# EAGLE design TinyTOG (EAGLE 4.16)
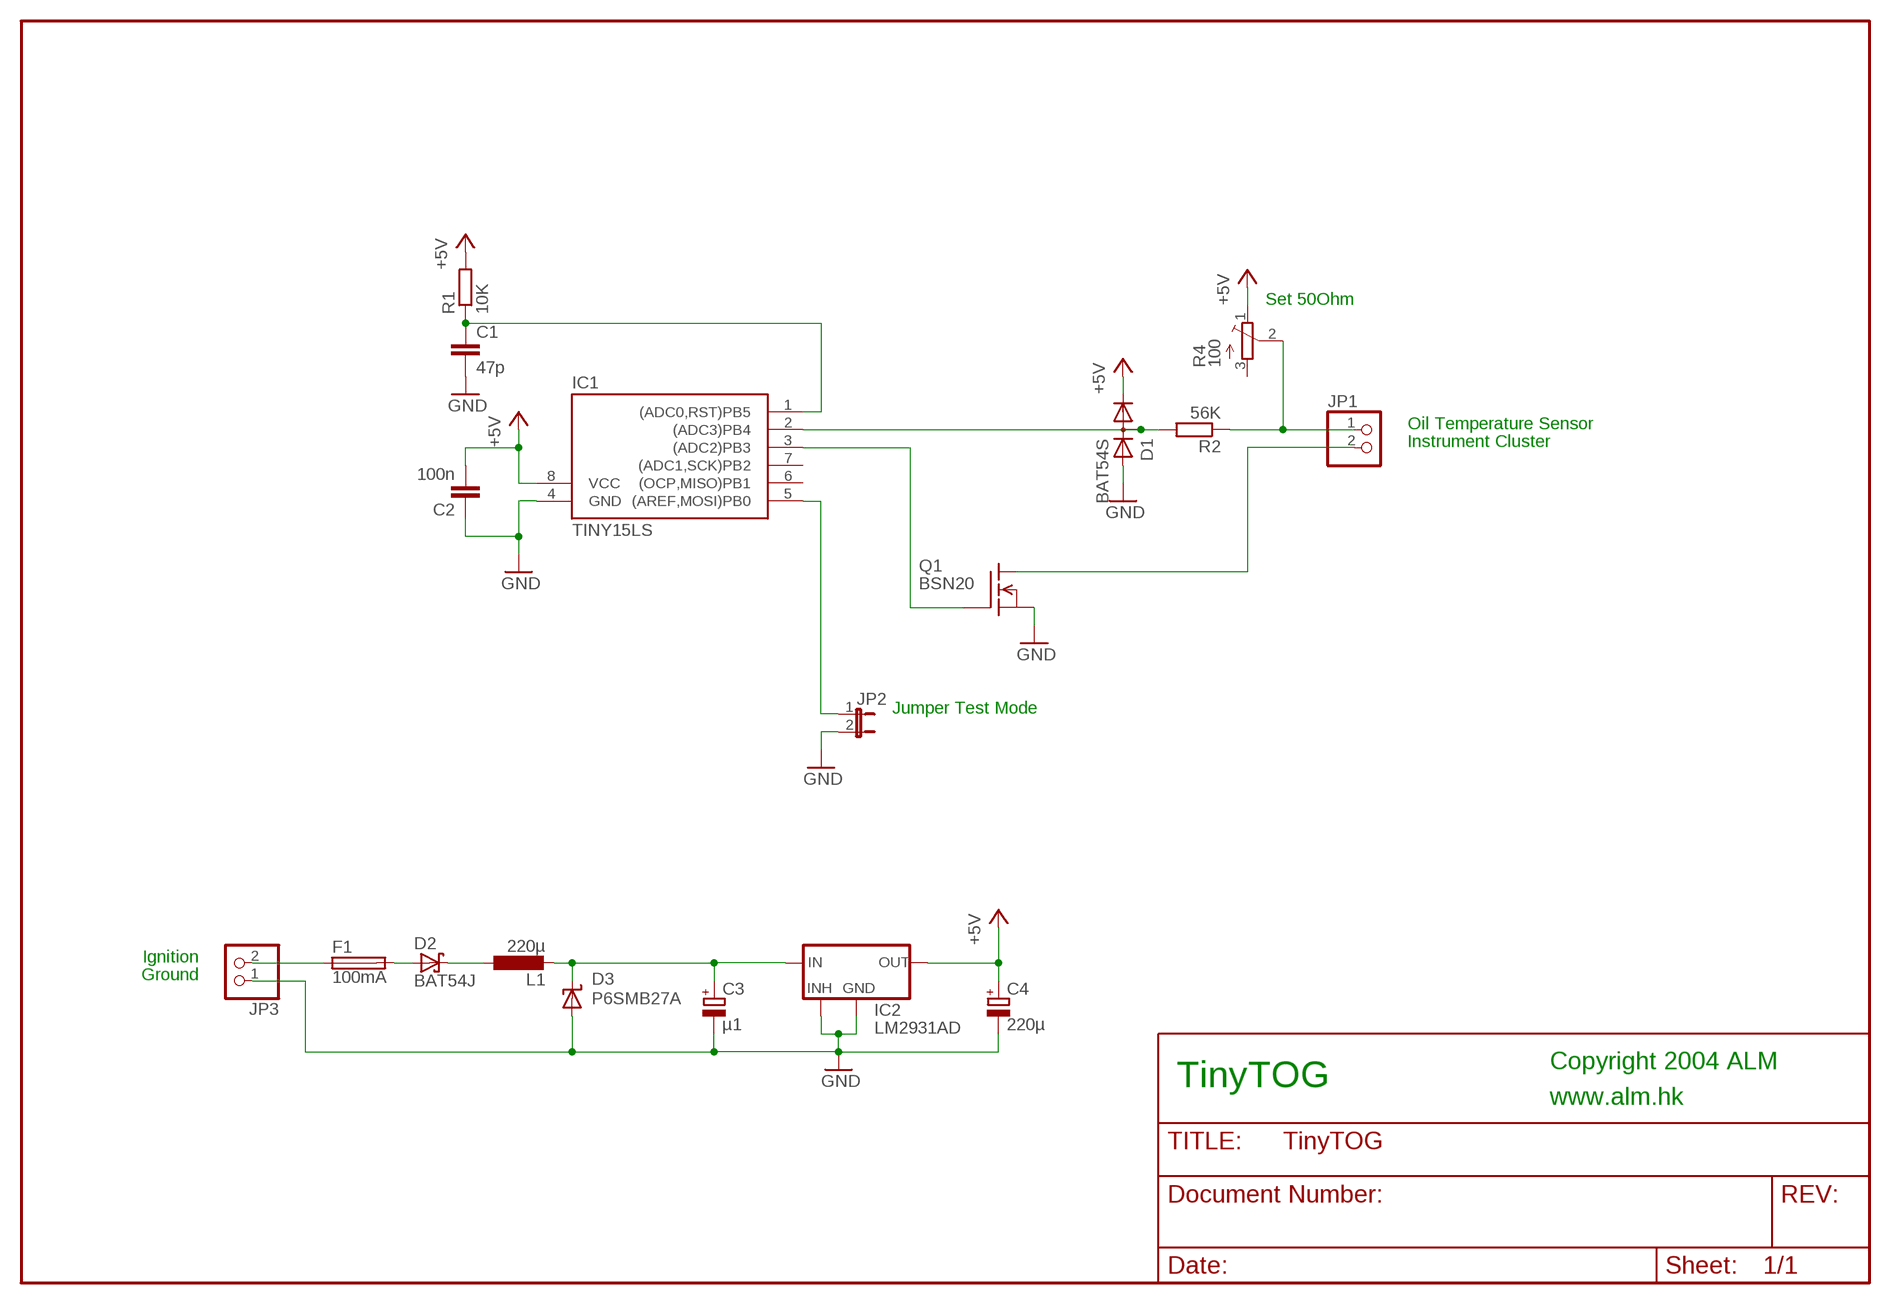
[diagram p0: schematic, sheet 1]

## Parts
C1  47p  C-EUC0805K  [C0805K]
C2  100n  C-EUC0805K  [C0805K]
C3  µ1  CPOL-EUSMCB  [SMC_B]
C4  220µ  CPOL-EUSMCC  [SMC_C]
D1  BAT54S  [SOT23]
D2  BAT54J  [SOD323]
D3  P6SMB27A  SUPPRESSOR-SMBJ  [SMBJ]
F1  100mA  MF-NSMF  [R1206W]
IC1  TINY15LS  [SOIC8]
IC2  LM2931AD  [SO08]
JP1  PINHD-1X2  [1X02]
JP2  JP1E  [JP1]
JP3  PINHD-1X2  [1X02]
L1  220µ  L-EU0207/7  [0207/7]
Q1  BSN20  [SOT23]
R1  10K  R-EU_R1206W  [R1206W]
R2  56K  R-EU_R1206W  [R1206W]
R4  100  TRIM_EU-B64WX  [B64WX]

## Nets
+5V: C2.2 C4.+ D1.2(C) IC1.8(VCC) IC2.1(OUT) R1.2 R4.1(E)
GND: C1.2 C2.1 C3.- C4.- D1.1(A) D3.A IC1.4(GND) IC2.2(GND) IC2.5(INH) JP2.2 JP3.1 Q1.2(S)
N$1: IC1.3((ADC2)PB3) Q1.1(G)
N$2: IC1.5((AREF,MOSI)PB0) JP2.1
N$3: C1.1 IC1.1((ADC0,RST)PB5) R1.1
N$4: JP1.1 R2.1 R4.2(S)
N$5: JP1.2 Q1.3(D)
N$6: D1.3(AC) IC1.2((ADC3)PB4) R2.2
N$7: C3.+ D3.C IC2.8(IN) L1.2
N$8: F1.1 JP3.2
N$9: D2.A F1.2
N$10: D2.K(C) L1.1
Unconnected: IC1.6((OCP,MISO)PB1) IC1.7((ADC1,SCK)PB2) R4.3(A)

## Notes on the sheet
- Set 50Ohm
- Oil Temperature Sensor
- Instrument Cluster
- Jumper Test Mode
- Ignition
- Ground
- Copyright 2004 ALM
- TinyTOG
- www.alm.hk

## Power pins joined to a net without a drawn wire
GND: IC2.3(GND) IC2.6(GND) IC2.7(GND)

## Library data of the parts
C1 C2 = rcl:C-EU: CAPACITOR, European symbol
C3 C4 = rcl:CPOL-EU: POLARIZED CAPACITOR, European symbol
D1 = diode:BAT54S
D2 = diode:BAT54J
D3 = diode:SUPPRESSOR-: Suppressor diode
F1 = eigene:MF-NSMF
IC1 = avr:TINY15L: MICROCONTROLLER 2.7 V 1 Kbytes FLASH 64 bytes EEPROM 4-channel 10 bit ADC
IC2 = eigene:LM2931AD
JP1 JP3 = pinhead:PINHD-1X2: PIN HEADER
JP2 = jumper:JP1E: JUMPER
L1 = rcl:L-EU: INDUCTOR, European symbol
Q1 = eigene:BSN20
R1 R2 = rcl:R-EU_: RESISTOR, European symbol
R4 = pot:TRIM_EU-: POTENTIOMETER

## Net classes
0 default: width 0.254 mm, clearance 0.6 mm

## Board
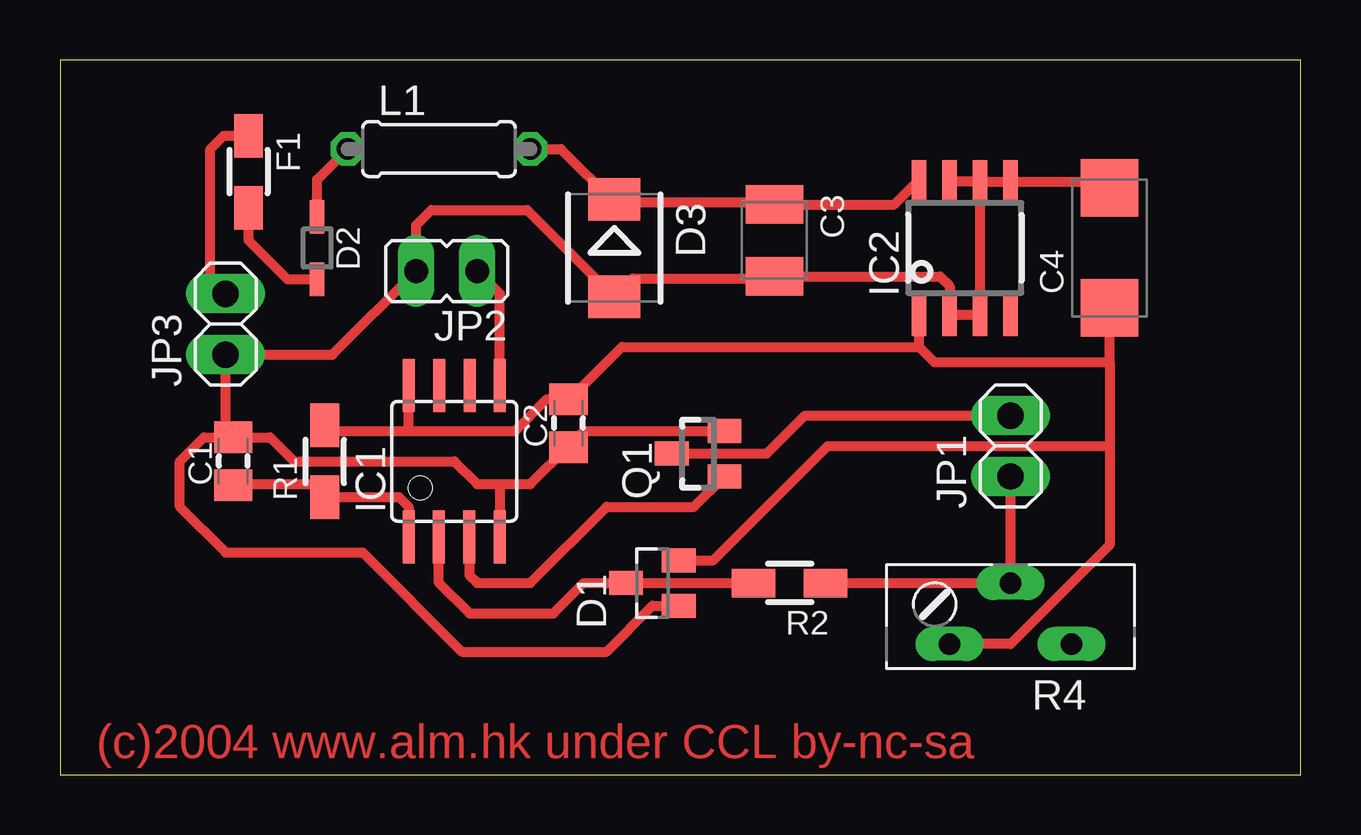
[diagram p1: board, top side]

Size 51.7 x 29.81 mm. Coordinates in mm from the lower left corner, seen from the top.
Outline: 0,29.81 0,0 51.7,0 51.7,29.81 0,29.81
Copper layers (1*16): Top 0.035mm / dielectric 1.5mm / Bottom 0.035mm
Design rules "8mils 25mil Dimension Abstand": minimum track width 10mil, minimum drill 24mil, track to track 8mil, track to pad 8mil, pad to pad 8mil, via to via 8mil, smd to smd 8mil, copper to edge 25mil, drill to drill 10mil, minimum pad ring 10mil, minimum via ring 8mil, stop-mask expansion 0mil, vias tented up to drill 0mil, thermal gap 10mil

### Footprints (pad centres in the part's own frame; a part is rotated, then mirrored left to right if it is on the bottom)
C0805K = smd 1.3 x 1.6: 1 -1,0; 2 1,0
SMC_B = smd 1.6 x 2.4: + -1.5,0; - 1.5,0
SMC_C = smd 2.4 x 2.4: + -2.5,0; - 2.5,0
SOT23 = smd 1 x 1.4: 1 -0.95,-1.1; 2 0.95,-1.1; 3 0,1.1
SOD323 = smd 1.4 x 0.6: A 1.3,0; K -1.3,0
SMBJ = smd 1.78 x 2.16: A 2.04,0; C -2.03,0
R1206W = smd 1.8 x 1.2: 1 -1.499,0; 2 1.499,0
SOIC8 = smd 0.5 x 2.2: 1 -1.905,-3.154; 2 -0.645,-3.154; 3 0.625,-3.154; 4 1.895,-3.154; 5 1.905,3.154; 6 0.635,3.154; 7 -0.635,3.154; 8 -1.905,3.154
SO08 = smd 0.6 x 1.8: 1 -1.905,-2.766; 2 -0.635,-2.766; 3 0.635,-2.766; 4 1.905,-2.766; 5 1.905,2.766; 6 0.635,2.766; 7 -0.635,2.766; 8 -1.905,2.766
1X02 = drill 1.1 long: 1 -1.27,0; 2 1.27,0
JP1 = drill 1 long: 1 0,-1.27; 2 0,1.27
0207/7 = drill 0.9 octagon: 1 -3.81,0; 2 3.81,0
B64WX = drill 0.9 long: 1 2.54,1.27; 3 -2.54,1.27 | drill 0.9 pad 1.321 long: 2 0,-1.27

### Placement (x,y rotation side)
C1  7.22,13.08 90 top
C2  21.19,14.67 90 top
C3  29.76,22.29 270 top
C4  43.73,21.97 90 top
D1  24.68,8 90 top
D2  10.71,21.97 270 top
D3  23.09,21.97 270 top
F1  7.86,25.14 270 top
IC1  16.43,13.08 0 top
IC2  37.7,21.97 0 top
JP1  39.6,13.71 90 top
JP2  16.11,21.01 90 top
JP3  6.9,18.79 90 top
L1  15.79,26.09 0 top
Q1  26.59,13.4 90 top
R1  11.03,13.08 90 top
R2  30.4,8 180 top
R4  39.6,6.73 180 top

### Tracks (layer width: path | path; a pad name or v marks a point on that pad's centre or on a via)
+5V
  Top 0.406: 14.52,16.25 IC1.8 14.52,14.35 | 11.03,14.03 R1.2 11.12,14.58 11.35,14.35 14.52,14.35 | 43.73,17.2 C4.+ | 35.79,17.84 IC2.1 | 35.79,17.84 36.43,17.2 43.73,17.2 | R4.1 39.61,5.46 43.73,9.59 43.73,13.71 | 43.73,17.2 43.73,13.71 | 35.79,17.84 23.41,17.84 21.24,15.67 C2.2 20.28,15.67 18.97,14.35 14.52,14.35 | D1.2 27.22,8.95 31.99,13.71 43.73,13.71
GND
  Top 0.406: 18.33,12.12 17.38,12.12 16.43,13.08 9.76,13.08 8.76,14.08 C1.2 | IC1.4 18.33,9.93 18.33,12.12 | C1.2 7.22,14.03 | IC2.7 38.24,24.73 38.33,24.82 | 38.33,24.82 IC2.6 IC2.3 38.33,19.11 38.24,19.2 IC2.2 37.07,20.38 36.66,20.79 C3.- 29.76,20.7 23.87,20.7 D3.A 19.47,23.55 15.47,23.55 14.84,22.92 JP2.2 11.35,17.52 JP3.1 6.9,14.4 C1.2 | 38.33,24.82 38.43,24.73 IC2.5 43.51,24.73 43.73,24.51 C4.- | 18.33,12.12 19.6,12.12 21.19,13.71 | 21.19,13.71 C2.1 | Q1.2 21.82,14.35 21.19,13.71 | D1.1 24.68,7.05 22.78,5.14 16.75,5.14 12.62,9.27 6.9,9.27 5,11.17 5,13.08 6,14.08 C1.2
N$1
  Top 0.406: IC1.3 17.05,8.33 17.38,8 19.6,8 22.78,11.17 26.41,11.17 Q1.1
N$2
  Top 0.406: IC1.5 18.33,20.06 JP2.1
N$3
  Top 0.406: 14.52,9.9 IC1.1 14.52,11.17 14.12,11.58 R1.1 10.48,12.12 7.22,12.12 C1.1
N$4
  Top 0.406: R2.1 R4.2 JP1.1
N$5
  Top 0.406: Q1.3 29.44,13.4 31.03,14.98 JP1.2
N$6
  Top 0.406: 15.79,9.9 IC1.2 15.78,8.01 17.06,6.73 20.55,6.73 21.82,8 D1.3 | D1.3 23.41,8 | D1.3 R2.2
N$7
  Top 0.406: IC2.8 35.79,24.82 34.75,23.79 C3.+ 29.76,23.87 23.22,23.87 D3.C 23.09,23.87 20.87,26.09 L1.2
N$8
  Top 0.406: JP3.2 6.27,20.7 6.27,26.09 6.81,26.64 F1.1
N$9
  Top 0.406: F1.2 7.86,22.29 9.47,20.67 D2.A
N$10
  Top 0.406: D2.K 10.71,24.82 L1.1

### Text on the board
Top: (c)2004 www.alm.hk under CCL by-nc-sa
Drill_legend: Bohrlegende | Datum: 14.12.2006 09:23:19 | 3 unterschiedliche Durchmesser | mit Standardsymbol! (18 Bohrungen) | 3.3000 mm / 129.921 mil | 3.0000 mm / 118.110 mil | 1.9000 mm / 74.803 mil | 1.5000 mm / 59.055 mil | 1.3000 mm / 51.181 mil | 1.1000 mm / 43.307 mil | 1.0000 mm / 39.370 mil | 0.9000 mm / 35.433 mil | 0.7000 mm / 27.559 mil